# EAGLE schematic PCB_midrat_v1 (EAGLE 9.7.0)
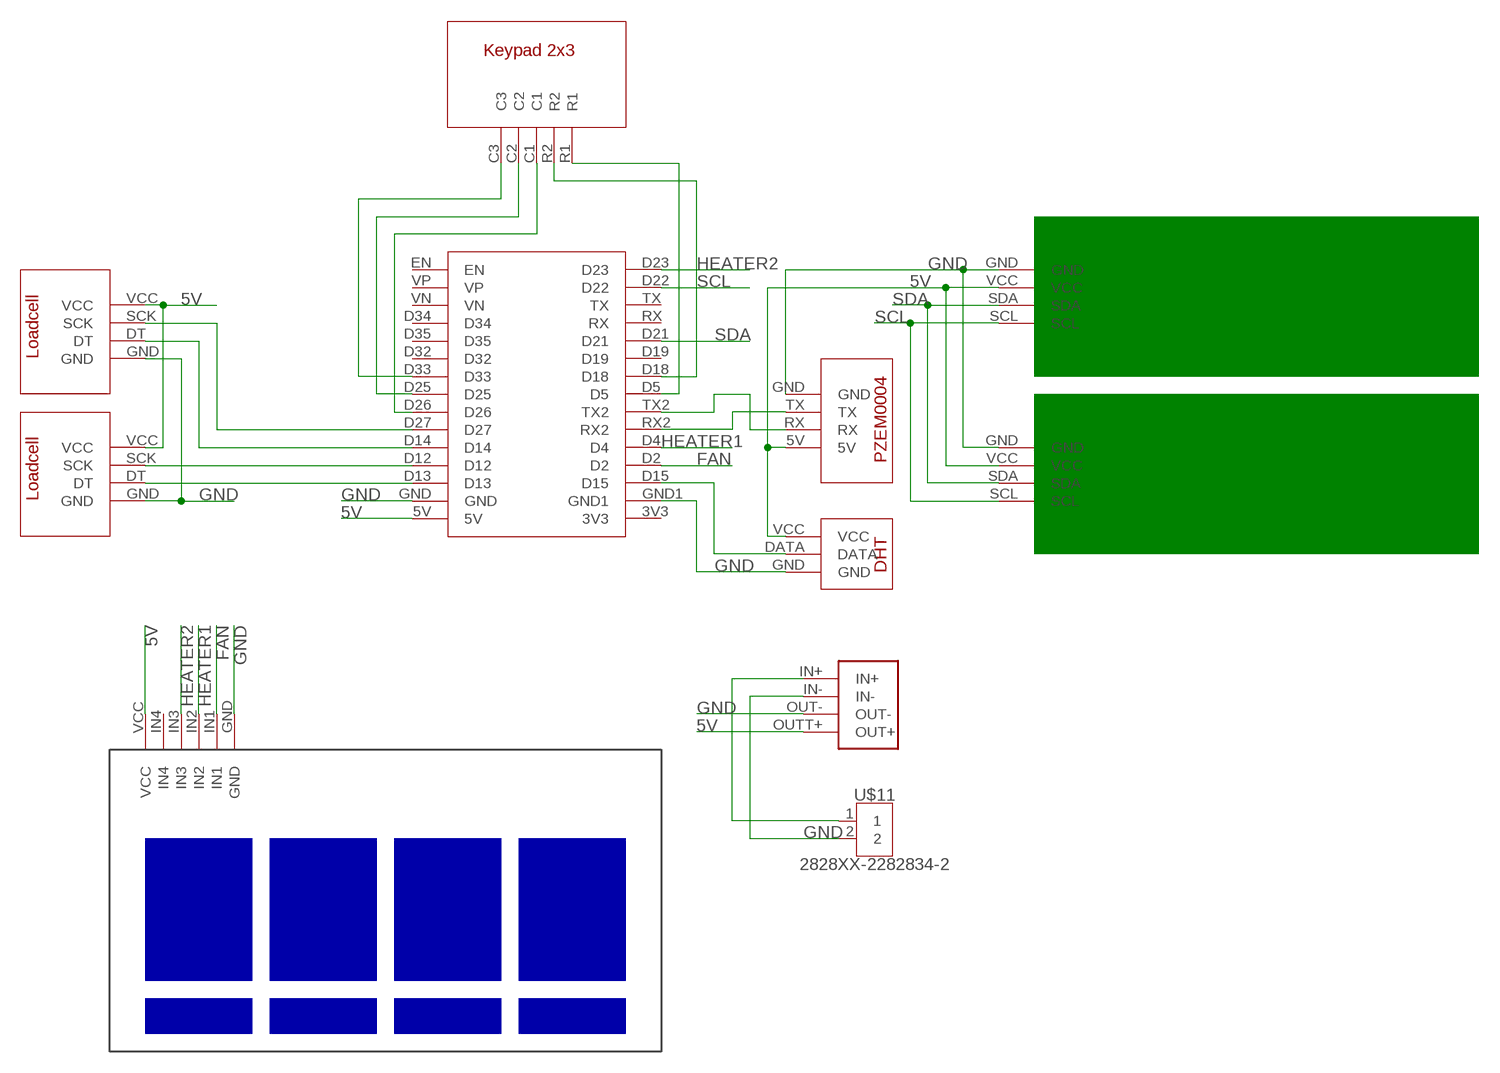
[diagram p0: schematic, sheet 1]

## Parts
U$1  ESP32_30PIN  [ESP32_30PIN]
U$2  KEYPAD_2X3  [KEYPAD2X3]
U$3  LCD_I2C  [LCD_I2C]
U$4  LOADCELL  [LOADCELL]
U$5  PZEM0004  [PZEM0004]
U$6  RELAY_4CHANNEL  [RELAY_4CHANNEL]
U$7  LOADCELL  [LOADCELL]
U$8  LCD_I2C  [LCD_I2C]
U$9  XL4005E1  [XL4005E1]
U$10  DHT  [DHT]
U$11  2828XX-2282834-2  [TERMBLK_254-2N]

## Nets
5V: U$1.5V U$3.VCC U$4.VCC U$5.5V U$6.VCC U$7.VCC U$8.VCC U$9.OUTT+(OUT+) U$10.VCC
FAN: U$1.D2 U$6.IN1
GND: U$1.GND U$1.GND1 U$3.GND U$4.GND U$5.GND U$6.GND U$7.GND U$8.GND U$9.IN- U$9.OUT- U$10.GND U$11.2
HEATER1: U$1.D4 U$6.IN2
HEATER2: U$1.D23 U$6.IN3
N$1: U$1.D13 U$4.DT
N$2: U$1.D12 U$4.SCK
N$3: U$1.D14 U$7.DT
N$4: U$1.D27 U$7.SCK
N$5: U$1.D26 U$2.C1
N$6: U$1.D25 U$2.C2
N$7: U$1.D33 U$2.C3
N$8: U$1.D5 U$2.R1
N$9: U$1.D18 U$2.R2
N$10: U$1.RX2 U$5.TX
N$11: U$1.TX2 U$5.RX
N$12: U$1.D15 U$10.DATA
N$13: U$9.IN+ U$11.1
SCL: U$1.D22 U$3.SCL U$8.SCL
SDA: U$1.D21 U$3.SDA U$8.SDA
Unconnected: U$1.3V3 U$1.D19 U$1.D32 U$1.D34 U$1.D35 U$1.EN U$1.RX U$1.TX U$1.VN U$1.VP U$6.IN4

## Library data of the parts
U$1 = FusionLocal:ESP32_30PIN
U$2 = FusionLocal:KEYPAD_2X3
U$3 U$8 = LocalLib:LCD_I2C
U$4 U$7 = FusionLocal:LOADCELL
U$5 = FusionLocal:PZEM0004
U$6 = LocalLib:RELAY_4CHANNEL
U$9 = FusionLocal:XL4005E1
U$10 = FusionLocal:DHT
U$11 = Connector:2828XX-2: 2 Position Wire to Board Terminal Block Horizontal with Board Datasheet <https://www.te.com.cn/commerce/DocumentDelivery/DDEController?Action=showdoc&DocId=Catalog+Section%7F1308389_EUROSTYLE_TERMINAL_BLOCKS%7F0607%7Fpdf%7FEnglish%7FENG_CS_1308389_EUROSTYLE_TERMINAL_BLOCKS_0607.pdf%7F2-282837-5>